# Altium schematic sheet notch+out.SchDoc
size A; SheetNumber: 5; SheetTotal: 5
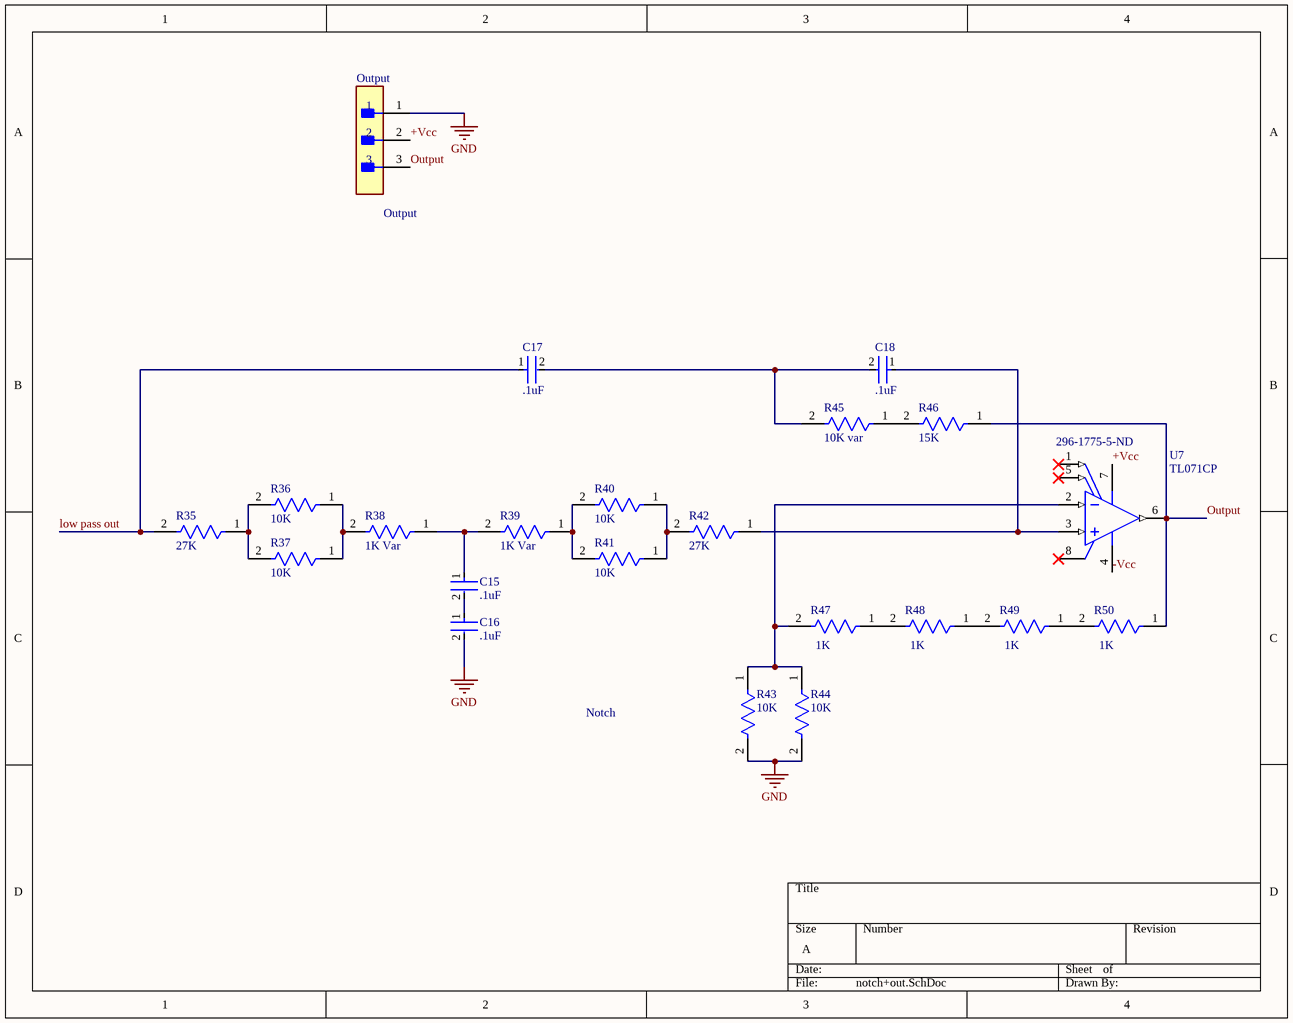
[diagram p0: notch+out.SchDoc]

## Parts
C15  .1uF  [FP-K15H5-MFG]
C16  .1uF  [FP-K15H5-MFG]
C17  .1uF  [FP-K15H5-MFG]
C18  .1uF  [FP-K15H5-MFG]
Output  87224-3  [FP-87224-3-MFG]  (value not drawn)
R35  27K  [FP-CFR-25-MFG]
R36  10K  [FP-CFR-25-MFG]
R37  10K  [FP-CFR-25-MFG]
R38  1K Var  [FP-CFR-25-MFG]
R39  1K Var  [FP-CFR-25-MFG]
R40  10K  [FP-CFR-25-MFG]
R41  10K  [FP-CFR-25-MFG]
R42  27K  [FP-CFR-25-MFG]
R43  10K  [FP-CFR-25-MFG]
R44  10K  [FP-CFR-25-MFG]
R45  10K var  [FP-CFR-25-MFG]
R46  15K  [FP-CFR-25-MFG]
R47  1K  [FP-CFR-25-MFG]
R48  1K  [FP-CFR-25-MFG]
R49  1K  [FP-CFR-25-MFG]
R50  1K  [FP-CFR-25-MFG]
U7  TL071CP  Supplier Part Number 1: 296-1775-5-ND  [P0008A]

## Nets
GND: C16.2 Output.1 R43.2 R44.2
+Vcc: Output.2 U7.7(VCC+)
-Vcc: U7.4(VCC-)
low pass out: C17.1 R35.2
Output: Output.3 R46.1 R50.1 U7.6(OUT)
NetC15_1: C15.1 R38.1 R39.2
NetC15_2: C15.2 C16.1
NetC17_2: C17.2 C18.2 R45.2
NetC18_1: C18.1 R42.1 U7.3(IN+)
NetR35_1: R35.1 R36.2 R37.2
NetR36_1: R36.1 R37.1 R38.2
NetR39_1: R39.1 R40.2 R41.2
NetR40_1: R40.1 R41.1 R42.2
NetR43_1: R43.1 R44.1 R47.2 U7.2(IN-)
NetR45_1: R45.1 R46.2
NetR47_1: R47.1 R48.2
NetR48_1: R48.1 R49.2
NetR49_1: R49.1 R50.2

Not connected (* = marked no-connect by the designer): U7 1(OFFSET_N1)* 5(OFFSET_N2)* 8(NC)*

## Notes on the sheet
- (near Output) Output
- Notch

## Library data of the parts
C15-C18 = CMP-02417-000048-1: CAP CER 0.1UF 50V X7R RADIAL; Capacitance: 100nF; Tolerance: 10%; Lead/Base Style: Formed Leads; Lead Length: 30mm; Lead Diameter: 0.5mm; Radiation Hardening: No; Lead Pitch: 5mm; Voltage: 50V; Mount: Through Hole; Package Quantity: 5000; Series: K; Case/Package: Dipped; Min Operating Temperature: -55°C; Depth: 2.5mm; Height - Seated (Max): 0.1inch; Voltage Rating (DC): 50V; Packaging: Bulk; RoHS Compliant: Yes; Construction: RADIAL; Thickness: 2.6mm; Max Operating Temperature: 125°C; Voltage Rating: 50V; Diameter: 500um; Dielectric: X7R; Width: 2.5mm; Length: 4mm; Weight: 0.005644oz; Termination: Radial; Height: 4mm
Output = CMP-2000-05697-2: CONN HEADER VERT 3POS 2.54MM; Number of Positions: 3; Gasket: No (Without); High Speed Serial Data Connector: No; Current Rating: 3A; Contact Post Length: 0.125inch; PCB Thickness: 1.397mm; PCB Mount Retention: Without; Connector Type: Plug; Approvals: CSA; PCB Mounting Orientation: Vertical; Pitch: 2.54mm; Mating Alignment: No (Without); Housing Color: Black; Contact Gender: Male; Length: 7.21mm; Max Operating Temperature: 105°C; Strain Relief: No (Without); Contact Material: Bronze; Row Spacing: 2.54mm; Series: AMPMODU MOD II; Board Standoff: No (Without); Package Quantity: 520; Radiation Hardening: No; Contact Protection: No (Without); Stabilizers: No (Without); Number of Rows: 1; Contact Mating Length: 8.08mm; Contact Shape: Square; Depth: 2.54mm; Contact Current Rating: 3A; Flammability Rating: UL94 V-0; Packaging: Carton; Number of Contacts: 3; Orientation: Straight; Mount: Through Hole; Keyed: No; Contact Type: Male Pin; Housing Material: Thermoplastic; High Temperature Housing: No; ELV: Compliant; Contact Plating: Gold; Termination: Through Hole; Selectively Loaded: No (Without); Lead Free: Lead Free; Min Operating Temperature: -65°C; Mating Connector Lock: No (Without); Color: Black; RoHS Compliant: Yes
R35-R50 = CMP-03413-000009-1: RES 10 OHM 1/4W 5% AXIAL; Resistance: 10R; Temperature Coefficient: 500ppm/°C; Max Power Dissipation: 250mW; RoHS Compliant: Yes; Packaging: Bulk; Series: Carbon Film; Case/Package: Axial; Max Operating Temperature: 155°C; Min Operating Temperature: -55°C; Number of Terminations: 2; Length: 0.248inch; Resistor Type: Carbon Film; Tolerance: 5%; Package Quantity: 200
U7 = CMP-0017-00972-2: Low-Noise JFET-Input General-Purpose Operational Amplifier, 7 to 36 V, 0 to 70 degC, 8-pin DIP (P8), Pb-Free (RoHS); Manufacturer: Texas Instruments; Total Supply Voltage(Min)(+5V is 5, +/-5V is 10): 7; Iq per channel(Max)(mA): 2.5; GBW(Typ)(MHz): 3; Vio (25C)(Max)(mV): 10; CMRR(Min)(dB): 70; Rating: Military; Vn at 1kHz(Typ)(nV/rtHz): 18; IIB(Max)(pA): 200; Number of Channels: 1; Sub Family: General Purpose Amplifier, High Supply Voltage Amplifier (>=30V); Total Supply Voltage(Max)(+5V is 5, +/-5V is 10): 36; Slew Rate(Typ)(V/us): 13; ComponentLink1Description: Manufacturer URL; PackageReference: P0008A; ComponentLink3Description: Package Specification; ComponentLink3URL: http://www.ti.com/litv/pdf/mpdi001b; Mounting Technology: Through Hole; ComponentLink2Description: Datasheet; ComponentLink2URL: http://www.ti.com/lit/ds/symlink/tl071.pdf; PartNumber: TL071CP; Eco-Plan: Pb-Free (RoHS); Offset Drift(Typ)(uV/C): 18; Code_JEDEC: MS-001; DatasheetVersion: SLOS080J; PackageVersion: 4040082/E, 04/2010; PackageDescription: 8-Pin Plastic In-Line, Body 9.59 x 6.35 mm, Pitch 2.54 mm; ComponentLink1URL: http://www.ti.com/; Supplier 1: Digi-Key